# Altium schematic sheet Sheet1.SchDoc
size A3; SheetNumber: 1; SheetTotal: 1
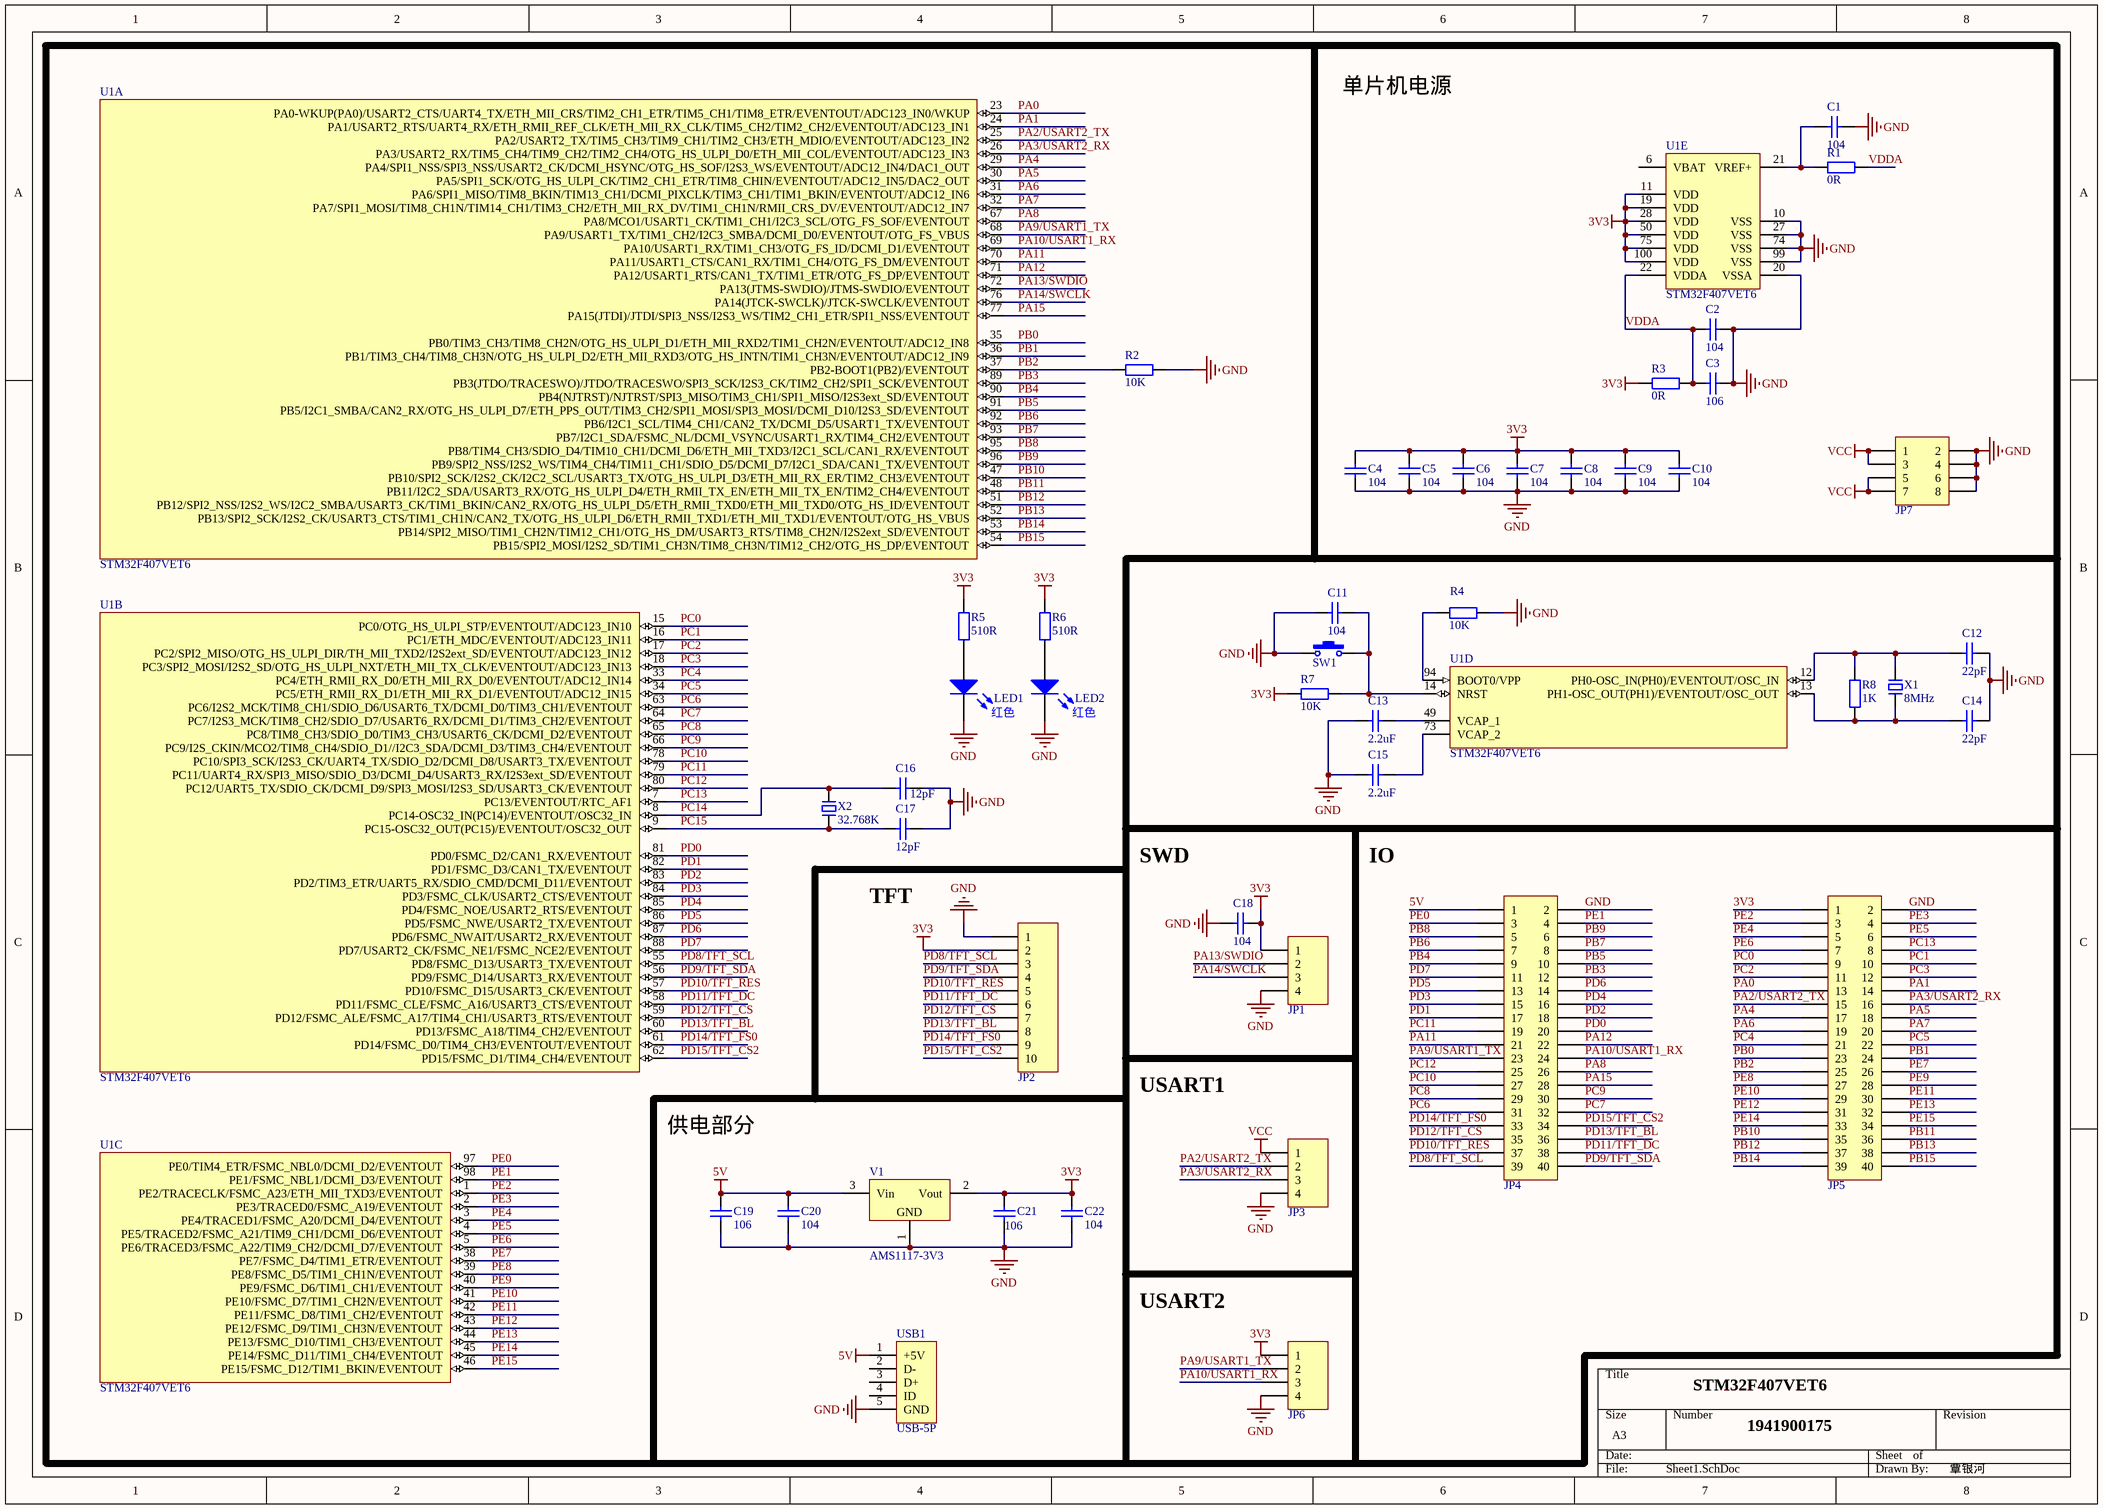
[diagram p0: Sheet1.SchDoc]

## Parts
C1  104  [C0603_M]
C2  104  [C0603_M]
C3  106  [C0603_M]
C4  104  [C0603_M]
C5  104  [C0603_M]
C6  104  [C0603_M]
C7  104  [C0603_M]
C8  104  [C0603_M]
C9  104  [C0603_M]
C10  104  [C0603_M]
C11  104  [C0603_M]
C12  22pF  [C0603_M]
C13  2.2uF  [C0603_M]
C14  22pF  [C0603_M]
C15  2.2uF  [C0603_M]
C16  12pF  [C0603_M]
C17  12pF  [C0603_M]
C18  104  [C0603_M]
C19  106  [C0603_M]
C20  104  [C0603_M]
C21  106  [C0603_M]
C22  104  [C0603_M]
LED1  LED  [LED0603_R]  (value not drawn)
LED2  LED  [LED0603_R]  (value not drawn)
P1  JP7  [HDR2X4]
P2  JP4  [HDR2X20]
P3  JP5  [HDR2X20]
P4  JP2  [HDR1X10]
P5  JP1  [HDR1X4]
P6  JP3  [HDR1X4]
P7  JP6  [HDR1X4]
R1  0R  [R0603_M]
R2  10K  [R0603_M]
R3  0R  [R0603_M]
R4  10K  [R0603_M]
R5  510R  [R0603_M]
R6  510R  [R0603_M]
R7  10K  [R0603_M]
R8  1K  [R0603_M]
SW1  3x6x5  [SW SMD-3*6*2.5]  (value not drawn)
U1  STM32F407VET6  [LQFP100_V]  (parts A,B,C,D,E of 5)
USB1  USB-5P  [USB-MICRO_A]
V1  AMS1117-3V3  [SOT89_L]
X1  8MHz  [OSC 3225-4P]
X2  32.768K  [OSC 6035-2P]

## Nets
3V3: C4.2 C5.2 C6.2 C7.2 C8.2 C9.2 C10.2 C18.2 C21.2 C22.2 P3.1 P4.2 P5.1 P7.1 R3.1 R5.2 R6.2 R7.1 U1.11(VDD) U1.19(VDD) U1.28(VDD) U1.50(VDD) U1.75(VDD) U1.100(VDD) V1.2(Vout)
5V: C19.2 C20.2 P2.1 USB1.1(+5V) V1.3(Vin)
GND: C1.2 C2.1 C3.1 C4.1 C5.1 C6.1 C7.1 C8.1 C9.1 C10.1 C11.2 C12.1 C13.2 C14.1 C15.2 C16.1 C17.1 C18.1 C19.1 C20.1 C21.1 C22.1 LED1.2(K) LED2.2(K) P1.2 P1.4 P1.6 P1.8 P2.2 P3.2 P4.1 P5.4 P6.4 P7.4 R2.2 R4.1 SW1.1 U1.10(VSS) U1.20(VSSA) U1.27(VSS) U1.74(VSS) U1.99(VSS) USB1.5(GND) V1.1(GND)
VCC: P1.1 P1.3 P1.5 P1.7 P6.1
PA0: P3.13 U1.23(PA0-WKUP(PA0)/USART2_CTS/UART4_TX/ETH_MII_CRS/TIM2_CH1_ETR/TIM5_CH1/TIM8_ETR/EVENTOUT/ADC123_IN0/WKUP)
PA1: P3.14 U1.24(PA1/USART2_RTS/UART4_RX/ETH_RMII_REF_CLK/ETH_MII_RX_CLK/TIM5_CH2/TIM2_CH2/EVENTOUT/ADC123_IN1)
PA2/USART2_TX: P3.15 P6.2 U1.25(PA2/USART2_TX/TIM5_CH3/TIM9_CH1/TIM2_CH3/ETH_MDIO/EVENTOUT/ADC123_IN2)
PA3/USART2_RX: P3.16 P6.3 U1.26(PA3/USART2_RX/TIM5_CH4/TIM9_CH2/TIM2_CH4/OTG_HS_ULPI_D0/ETH_MII_COL/EVENTOUT/ADC123_IN3)
PA4: P3.17 U1.29(PA4/SPI1_NSS/SPI3_NSS/USART2_CK/DCMI_HSYNC/OTG_HS_SOF/I2S3_WS/EVENTOUT/ADC12_IN4/DAC1_OUT)
PA5: P3.18 U1.30(PA5/SPI1_SCK/OTG_HS_ULPI_CK/TIM2_CH1_ETR/TIM8_CHIN/EVENTOUT/ADC12_IN5/DAC2_OUT)
PA6: P3.19 U1.31(PA6/SPI1_MISO/TIM8_BKIN/TIM13_CH1/DCMI_PIXCLK/TIM3_CH1/TIM1_BKIN/EVENTOUT/ADC12_IN6)
PA7: P3.20 U1.32(PA7/SPI1_MOSI/TIM8_CH1N/TIM14_CH1/TIM3_CH2/ETH_MII_RX_DV/TIM1_CH1N/RMII_CRS_DV/EVENTOUT/ADC12_IN7)
PA8: P2.26 U1.67(PA8/MCO1/USART1_CK/TIM1_CH1/I2C3_SCL/OTG_FS_SOF/EVENTOUT)
PA9/USART1_TX: P2.23 P7.2 U1.68(PA9/USART1_TX/TIM1_CH2/I2C3_SMBA/DCMI_D0/EVENTOUT/OTG_FS_VBUS)
PA10/USART1_RX: P2.24 P7.3 U1.69(PA10/USART1_RX/TIM1_CH3/OTG_FS_ID/DCMI_D1/EVENTOUT)
PA11: P2.21 U1.70(PA11/USART1_CTS/CAN1_RX/TIM1_CH4/OTG_FS_DM/EVENTOUT)
PA12: P2.22 U1.71(PA12/USART1_RTS/CAN1_TX/TIM1_ETR/OTG_FS_DP/EVENTOUT)
PA13/SWDIO: P5.2 U1.72(PA13(JTMS-SWDIO)/JTMS-SWDIO/EVENTOUT)
PA14/SWCLK: P5.3 U1.76(PA14(JTCK-SWCLK)/JTCK-SWCLK/EVENTOUT)
PA15: P2.28 U1.77(PA15(JTDI)/JTDI/SPI3_NSS/I2S3_WS/TIM2_CH1_ETR/SPI1_NSS/EVENTOUT)
PB0: P3.23 U1.35(PB0/TIM3_CH3/TIM8_CH2N/OTG_HS_ULPI_D1/ETH_MII_RXD2/TIM1_CH2N/EVENTOUT/ADC12_IN8)
PB1: P3.24 U1.36(PB1/TIM3_CH4/TIM8_CH3N/OTG_HS_ULPI_D2/ETH_MII_RXD3/OTG_HS_INTN/TIM1_CH3N/EVENTOUT/ADC12_IN9)
PB2: P3.25 R2.1 U1.37(PB2-BOOT1(PB2)/EVENTOUT)
PB3: P2.12 U1.89(PB3(JTDO/TRACESWO)/JTDO/TRACESWO/SPI3_SCK/I2S3_CK/TIM2_CH2/SPI1_SCK/EVENTOUT)
PB4: P2.9 U1.90(PB4(NJTRST)/NJTRST/SPI3_MISO/TIM3_CH1/SPI1_MISO/I2S3ext_SD/EVENTOUT)
PB5: P2.10 U1.91(PB5/I2C1_SMBA/CAN2_RX/OTG_HS_ULPI_D7/ETH_PPS_OUT/TIM3_CH2/SPI1_MOSI/SPI3_MOSI/DCMI_D10/I2S3_SD/EVENTOUT)
PB6: P2.7 U1.92(PB6/I2C1_SCL/TIM4_CH1/CAN2_TX/DCMI_D5/USART1_TX/EVENTOUT)
PB7: P2.8 U1.93(PB7/I2C1_SDA/FSMC_NL/DCMI_VSYNC/USART1_RX/TIM4_CH2/EVENTOUT)
PB8: P2.5 U1.95(PB8/TIM4_CH3/SDIO_D4/TIM10_CH1/DCMI_D6/ETH_MII_TXD3/I2C1_SCL/CAN1_RX/EVENTOUT)
PB9: P2.6 U1.96(PB9/SPI2_NSS/I2S2_WS/TIM4_CH4/TIM11_CH1/SDIO_D5/DCMI_D7/I2C1_SDA/CAN1_TX/EVENTOUT)
PB10: P3.35 U1.47(PB10/SPI2_SCK/I2S2_CK/I2C2_SCL/USART3_TX/OTG_HS_ULPI_D3/ETH_MII_RX_ER/TIM2_CH3/EVENTOUT)
PB11: P3.36 U1.48(PB11/I2C2_SDA/USART3_RX/OTG_HS_ULPI_D4/ETH_RMII_TX_EN/ETH_MII_TX_EN/TIM2_CH4/EVENTOUT)
PB12: P3.37 U1.51(PB12/SPI2_NSS/I2S2_WS/I2C2_SMBA/USART3_CK/TIM1_BKIN/CAN2_RX/OTG_HS_ULPI_D5/ETH_RMII_TXD0/ETH_MII_TXD0/OTG_HS_ID/EVENTOUT)
PB13: P3.38 U1.52(PB13/SPI2_SCK/I2S2_CK/USART3_CTS/TIM1_CH1N/CAN2_TX/OTG_HS_ULPI_D6/ETH_RMII_TXD1/ETH_MII_TXD1/EVENTOUT/OTG_HS_VBUS)
PB14: P3.39 U1.53(PB14/SPI2_MISO/TIM1_CH2N/TIM12_CH1/OTG_HS_DM/USART3_RTS/TIM8_CH2N/I2S2ext_SD/EVENTOUT)
PB15: P3.40 U1.54(PB15/SPI2_MOSI/I2S2_SD/TIM1_CH3N/TIM8_CH3N/TIM12_CH2/OTG_HS_DP/EVENTOUT)
PC0: P3.9 U1.15(PC0/OTG_HS_ULPI_STP/EVENTOUT/ADC123_IN10)
PC1: P3.10 U1.16(PC1/ETH_MDC/EVENTOUT/ADC123_IN11)
PC2: P3.11 U1.17(PC2/SPI2_MISO/OTG_HS_ULPI_DIR/TH_MII_TXD2/I2S2ext_SD/EVENTOUT/ADC123_IN12)
PC3: P3.12 U1.18(PC3/SPI2_MOSI/I2S2_SD/OTG_HS_ULPI_NXT/ETH_MII_TX_CLK/EVENTOUT/ADC123_IN13)
PC4: P3.21 U1.33(PC4/ETH_RMII_RX_D0/ETH_MII_RX_D0/EVENTOUT/ADC12_IN14)
PC5: P3.22 U1.34(PC5/ETH_RMII_RX_D1/ETH_MII_RX_D1/EVENTOUT/ADC12_IN15)
PC6: P2.31 U1.63(PC6/I2S2_MCK/TIM8_CH1/SDIO_D6/USART6_TX/DCMI_D0/TIM3_CH1/EVENTOUT)
PC7: P2.32 U1.64(PC7/I2S3_MCK/TIM8_CH2/SDIO_D7/USART6_RX/DCMI_D1/TIM3_CH2/EVENTOUT)
PC8: P2.29 U1.65(PC8/TIM8_CH3/SDIO_D0/TIM3_CH3/USART6_CK/DCMI_D2/EVENTOUT)
PC9: P2.30 U1.66(PC9/I2S_CKIN/MCO2/TIM8_CH4/SDIO_D1//I2C3_SDA/DCMI_D3/TIM3_CH4/EVENTOUT)
PC10: P2.27 U1.78(PC10/SPI3_SCK/I2S3_CK/UART4_TX/SDIO_D2/DCMI_D8/USART3_TX/EVENTOUT)
PC11: P2.19 U1.79(PC11/UART4_RX/SPI3_MISO/SDIO_D3/DCMI_D4/USART3_RX/I2S3ext_SD/EVENTOUT)
PC12: P2.25 U1.80(PC12/UART5_TX/SDIO_CK/DCMI_D9/SPI3_MOSI/I2S3_SD/USART3_CK/EVENTOUT)
PC13: P3.8 U1.7(PC13/EVENTOUT/RTC_AF1)
PC14: C16.2 U1.8(PC14-OSC32_IN(PC14)/EVENTOUT/OSC32_IN) X2.2
PC15: C17.2 U1.9(PC15-OSC32_OUT(PC15)/EVENTOUT/OSC32_OUT) X2.1
PD0: P2.20 U1.81(PD0/FSMC_D2/CAN1_RX/EVENTOUT)
PD1: P2.17 U1.82(PD1/FSMC_D3/CAN1_TX/EVENTOUT)
PD2: P2.18 U1.83(PD2/TIM3_ETR/UART5_RX/SDIO_CMD/DCMI_D11/EVENTOUT)
PD3: P2.15 U1.84(PD3/FSMC_CLK/USART2_CTS/EVENTOUT)
PD4: P2.16 U1.85(PD4/FSMC_NOE/USART2_RTS/EVENTOUT)
PD5: P2.13 U1.86(PD5/FSMC_NWE/USART2_TX/EVENTOUT)
PD6: P2.14 U1.87(PD6/FSMC_NWAIT/USART2_RX/EVENTOUT)
PD7: P2.11 U1.88(PD7/USART2_CK/FSMC_NE1/FSMC_NCE2/EVENTOUT)
PD8/TFT_SCL: P2.39 P4.3 U1.55(PD8/FSMC_D13/USART3_TX/EVENTOUT)
PD9/TFT_SDA: P2.40 P4.4 U1.56(PD9/FSMC_D14/USART3_RX/EVENTOUT)
PD10/TFT_RES: P2.37 P4.5 U1.57(PD10/FSMC_D15/USART3_CK/EVENTOUT)
PD11/TFT_DC: P2.38 P4.6 U1.58(PD11/FSMC_CLE/FSMC_A16/USART3_CTS/EVENTOUT)
PD12/TFT_CS: P2.35 P4.7 U1.59(PD12/FSMC_ALE/FSMC_A17/TIM4_CH1/USART3_RTS/EVENTOUT)
PD13/TFT_BL: P2.36 P4.8 U1.60(PD13/FSMC_A18/TIM4_CH2/EVENTOUT)
PD14/TFT_FS0: P2.33 P4.9 U1.61(PD14/FSMC_D0/TIM4_CH3/EVENTOUT/EVENTOUT)
PD15/TFT_CS2: P2.34 P4.10 U1.62(PD15/FSMC_D1/TIM4_CH4/EVENTOUT)
PE0: P2.3 U1.97(PE0/TIM4_ETR/FSMC_NBL0/DCMI_D2/EVENTOUT)
PE1: P2.4 U1.98(PE1/FSMC_NBL1/DCMI_D3/EVENTOUT)
PE2: P3.3 U1.1(PE2/TRACECLK/FSMC_A23/ETH_MII_TXD3/EVENTOUT)
PE3: P3.4 U1.2(PE3/TRACED0/FSMC_A19/EVENTOUT)
PE4: P3.5 U1.3(PE4/TRACED1/FSMC_A20/DCMI_D4/EVENTOUT)
PE5: P3.6 U1.4(PE5/TRACED2/FSMC_A21/TIM9_CH1/DCMI_D6/EVENTOUT)
PE6: P3.7 U1.5(PE6/TRACED3/FSMC_A22/TIM9_CH2/DCMI_D7/EVENTOUT)
PE7: P3.26 U1.38(PE7/FSMC_D4/TIM1_ETR/EVENTOUT)
PE8: P3.27 U1.39(PE8/FSMC_D5/TIM1_CH1N/EVENTOUT)
PE9: P3.28 U1.40(PE9/FSMC_D6/TIM1_CH1/EVENTOUT)
PE10: P3.29 U1.41(PE10/FSMC_D7/TIM1_CH2N/EVENTOUT)
PE11: P3.30 U1.42(PE11/FSMC_D8/TIM1_CH2/EVENTOUT)
PE12: P3.31 U1.43(PE12/FSMC_D9/TIM1_CH3N/EVENTOUT)
PE13: P3.32 U1.44(PE13/FSMC_D10/TIM1_CH3/EVENTOUT)
PE14: P3.33 U1.45(PE14/FSMC_D11/TIM1_CH4/EVENTOUT)
PE15: P3.34 U1.46(PE15/FSMC_D12/TIM1_BKIN/EVENTOUT)
VDDA: C2.2 C3.2 R1.2 R3.2 U1.22(VDDA)
NetC1_1: C1.1 R1.1 U1.21(VREF+)
NetC11_1: C11.1 R7.2 SW1.2 U1.14(NRST)
NetC12_2: C12.2 R8.2 U1.12(PH0-OSC_IN(PH0)/EVENTOUT/OSC_IN) X1.2
NetC13_1: C13.1 U1.49(VCAP_1)
NetC14_2: C14.2 R8.1 U1.13(PH1-OSC_OUT(PH1)/EVENTOUT/OSC_OUT) X1.1
NetC15_1: C15.1 U1.73(VCAP_2)
NetLED1_1: LED1.1(A) R5.1
NetLED2_1: LED2.1(A) R6.1
NetR4_2: R4.2 U1.94(BOOT0/VPP)

Not connected (* = marked no-connect by the designer): U1 6(VBAT); USB1 2(D-) 3(D+) 4(ID)

## Notes on the sheet
- 单片机电源
- 红色
- (near LED2) 红色
- TFT
- SWD
- IO
- USART1
- 供电部分
- USART2
- STM32F407VET6
- 1941900175
- 覃银河

## Library data of the parts
C1-C22 = C: 贴片电容; BOM名称: 无极性贴片电容; 联系卖家，免费查找封装: 唯一出售店铺网址https://shop463601444.taobao.com
LED1 LED2 = LED: 发光二极管; 封装库来自淘宝卖家 ID：黄晶宝石: 其他店铺购入均为假冒，请立即申请退款，本店奖励现金5~20元
P1 = Header 4X2: Header, 4-Pin, Dual row; LatestRevisionDate: 17-Jul-2002; LatestRevisionNote: Re-released for DXP Platform.; Publisher: Altium Limited
P2 P3 = Header 20X2: Header, 20-Pin, Dual row; LatestRevisionDate: 17-Jul-2002; LatestRevisionNote: Re-released for DXP Platform.; Publisher: Altium Limited
P4 = Header 10: Header, 10-Pin; LatestRevisionDate: 17-Jul-2002; LatestRevisionNote: Re-released for DXP Platform.; Publisher: Altium Limited
P5-P7 = Header 4: Header, 4-Pin; LatestRevisionDate: 17-Jul-2002; LatestRevisionNote: Re-released for DXP Platform.; Publisher: Altium Limited
R1-R8 = R: 贴片电阻; 联系卖家，免费查找封装: 唯一出售店铺网址https://shop463601444.taobao.com; 封装库来自淘宝卖家ID：黄晶宝石: 其他店铺购入均为盗版假冒封装库，请立即申请退款; BOM名称: 贴片电阻
SW1 = SW-PB: 微动开关; BOM名称: 3x6轻触开关; 联系卖家，免费查找封装: 唯一出售店铺网址https://shop463601444.taobao.com
U1 = STM32F407VET6: ARM Cortex-M4 32b MCU+FPU, 210DMIP, 512 kB Flash, 192+4 kB RAM, Camera, 82 I/Os, 100-pin LQFP, -40 to +85癈, Tray; Internal RAM: 192kB; Operating Frequency (Processor Speed): 168MHz; A/D Converter: 16x12-bit; D/A Converter: 2x12-bit; 16-bit Timers (IC/OC/PWM): 12x16-bit(24/24/30); 32-bit Timer (IC/OC/PWM): 2x32-bit (8/8/8); Other Timer Functions: 2xWDG, RTC, 24-bit down counter; Serial Interface: 3xSPI/2xI2S/2xI2C/3xUSART(IrDa, ISO7816)/3xUART/2xUSB OTG FS/HS, 2xCAN/Ethernet MAC10/100, SDIO; 联系卖家，免费查找封装: 唯一出售店铺网址https://shop463601444.taobao.com; DatasheetVersion: rev2, Jan-2012; PackageVersion: 2012; PackageReference: LQFP100; PackageDescription: 100-Pin Low Profile Quad Flat Package, 14x14 mm Body, 0.5 mm Pitch; ComponentLink1Description: Manufacturer URL; ComponentLink1URL: http://www.st.com/; ComponentLink2Description: STM32F405/7 Datasheet; ComponentLink2URL: http://www.st.com/internet/com/TECHNICAL_RESOURCES/TECHNICAL_LITERATURE/DATASHEET/DM00037051.pdf; ComponentLink3Description: STM32F4 Web Page; ComponentLink3URL: http://www.st.com/internet/mcu/subclass/1521.jsp
USB1 = USB-5P: 微型USB母座; 联系卖家，免费技术支持: 唯一出售店铺网址https://shop463601444.taobao.com; BOM名称: 微型USB母座
V1 = AMS1117_SOT89: 三端稳压芯片; BOM名称: 稳压芯片; 封装库来自淘宝卖家 ID：黄晶宝石: 其他店铺购入均为盗版，请立即申请退款，本店现金奖励5~20元; 联系卖家 免费查找封装: 唯一出售店铺网址https://shop463601444.taobao.com
X1 X2 = XTAL-2P: 2脚无源脚晶振; 版权归属: 源创客; BOM名称: 2脚无源脚晶振; 学习资源: www.ooocke.com